# EAGLE design nedonand2 (EAGLE 5.12)
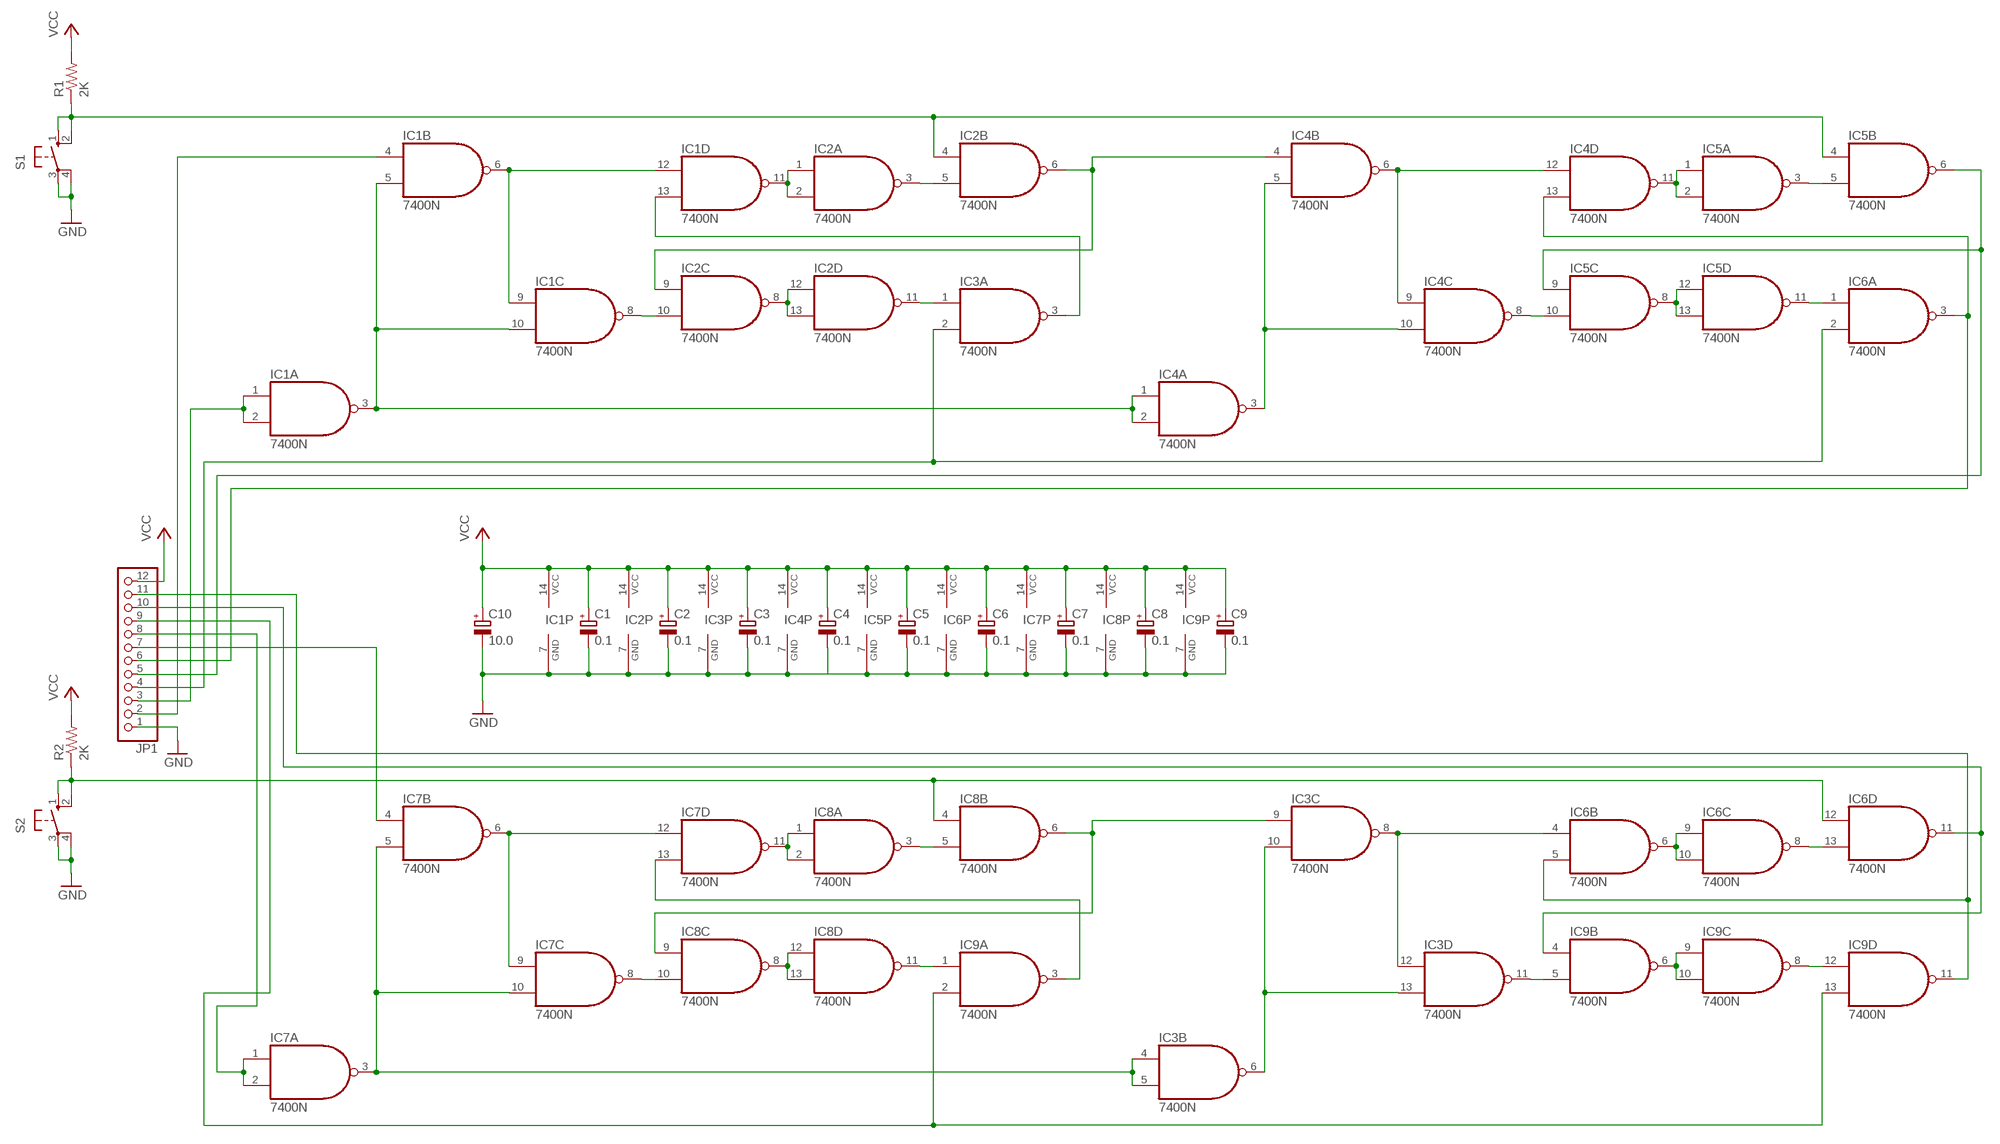
[diagram p0: schematic, sheet 1]

## Parts
C1  0.1  CPOL-EUB45181A  [B45181A]
C2  0.1  CPOL-EUB45181A  [B45181A]
C3  0.1  CPOL-EUB45181A  [B45181A]
C4  0.1  CPOL-EUB45181A  [B45181A]
C5  0.1  CPOL-EUB45181A  [B45181A]
C6  0.1  CPOL-EUB45181A  [B45181A]
C7  0.1  CPOL-EUB45181A  [B45181A]
C8  0.1  CPOL-EUB45181A  [B45181A]
C9  0.1  CPOL-EUB45181A  [B45181A]
C10  10.0  CPOL-EUE2.5-5  [E2,5-5]
IC1  7400N  [DIL14]
IC2  7400N  [DIL14]
IC3  7400N  [DIL14]
IC4  7400N  [DIL14]
IC5  7400N  [DIL14]
IC6  7400N  [DIL14]
IC7  7400N  [DIL14]
IC8  7400N  [DIL14]
IC9  7400N  [DIL14]
JP1  PINHD-1X12/90  [1X12/90]
R1  2K  R-US_0204/7  [0204/7]
R2  2K  R-US_0204/7  [0204/7]
S1  10-XX  [B3F-10XX]
S2  10-XX  [B3F-10XX]

## Nets
GND: C1.- C2.- C3.- C4.- C5.- C6.- C7.- C8.- C9.- C10.- IC1.7(P:GND) IC2.7(P:GND) IC3.7(P:GND) IC4.7(P:GND) IC5.7(P:GND) IC6.7(P:GND) IC7.7(P:GND) IC8.7(P:GND) IC9.7(P:GND) JP1.1 S1.3(P) S1.4(P1) S2.3(P) S2.4(P1)
N$1: IC7.6(B:O) IC7.9(C:I0) IC7.12(D:I0)
N$2: IC1.6(B:O) IC1.9(C:I0) IC1.12(D:I0)
N$3: IC1.8(C:O) IC2.10(C:I1)
N$4: IC2.8(C:O) IC2.12(D:I0) IC2.13(D:I1)
N$5: IC1.11(D:O) IC2.1(A:I0) IC2.2(A:I1)
N$6: IC2.3(A:O) IC2.5(B:I1)
N$7: IC2.11(D:O) IC3.1(A:I0)
N$8: IC7.4(B:I0) JP1.7
N$9: IC7.8(C:O) IC8.10(C:I1)
N$10: IC1.4(B:I0) JP1.2
N$11: IC1.1(A:I0) IC1.2(A:I1) JP1.3
N$12: IC8.8(C:O) IC8.12(D:I0) IC8.13(D:I1)
N$13: IC4.13(D:I1) IC6.3(A:O) JP1.6
N$14: IC2.6(B:O) IC2.9(C:I0) IC4.4(B:I0)
N$15: IC5.6(B:O) IC5.9(C:I0) JP1.5
N$16: IC1.13(D:I1) IC3.3(A:O)
N$17: IC4.3(A:O) IC4.5(B:I1) IC4.10(C:I1)
N$18: IC4.6(B:O) IC4.9(C:I0) IC4.12(D:I0)
N$19: IC4.8(C:O) IC5.10(C:I1)
N$20: IC5.8(C:O) IC5.12(D:I0) IC5.13(D:I1)
N$21: IC4.11(D:O) IC5.1(A:I0) IC5.2(A:I1)
N$22: IC5.3(A:O) IC5.5(B:I1)
N$23: IC5.11(D:O) IC6.1(A:I0)
N$24: IC2.4(B:I0) IC5.4(B:I0) R1.1 S1.1(S) S1.2(S1)
N$25: IC7.11(D:O) IC8.1(A:I0) IC8.2(A:I1)
N$26: IC1.3(A:O) IC1.5(B:I1) IC1.10(C:I1) IC4.1(A:I0) IC4.2(A:I1)
N$27: IC3.2(A:I1) IC6.2(A:I1) JP1.4
N$28: IC8.3(A:O) IC8.5(B:I1)
N$29: IC8.11(D:O) IC9.1(A:I0)
N$31: IC7.1(A:I0) IC7.2(A:I1) JP1.8
N$32: IC6.5(B:I1) IC9.11(D:O) JP1.11
N$33: IC6.11(D:O) IC9.4(B:I0) JP1.10
N$34: IC3.9(C:I0) IC8.6(B:O) IC8.9(C:I0)
N$35: IC7.13(D:I1) IC9.3(A:O)
N$36: IC3.6(B:O) IC3.10(C:I1) IC3.13(D:I1)
N$37: IC3.8(C:O) IC3.12(D:I0) IC6.4(B:I0)
N$38: IC3.11(D:O) IC9.5(B:I1)
N$39: IC9.6(B:O) IC9.9(C:I0) IC9.10(C:I1)
N$40: IC6.6(B:O) IC6.9(C:I0) IC6.10(C:I1)
N$41: IC6.8(C:O) IC6.13(D:I1)
N$42: IC9.8(C:O) IC9.12(D:I0)
N$43: IC6.12(D:I0) IC8.4(B:I0) R2.1 S2.1(S) S2.2(S1)
N$44: IC3.4(B:I0) IC3.5(B:I1) IC7.3(A:O) IC7.5(B:I1) IC7.10(C:I1)
N$45: IC9.2(A:I1) IC9.13(D:I1) JP1.9
VCC: C1.+ C2.+ C3.+ C4.+ C5.+ C6.+ C7.+ C8.+ C9.+ C10.+ IC1.14(P:VCC) IC2.14(P:VCC) IC3.14(P:VCC) IC4.14(P:VCC) IC5.14(P:VCC) IC6.14(P:VCC) IC7.14(P:VCC) IC8.14(P:VCC) IC9.14(P:VCC) JP1.12 R1.2 R2.2

## Library data of the parts
C1-C10 = rcl:CPOL-EU: POLARIZED CAPACITOR, European symbol
IC1-IC9 = 74xx-us:74*00: Quad 2-input NAND gate
JP1 = pinhead:PINHD-1X12: PIN HEADER
R1 R2 = resistor:R-US_: RESISTOR, American symbol
S1 S2 = switch-omron:10-XX: OMRON SWITCH; MPN: B3F-1000; OC_FARNELL: 176432; OC_NEWARK: 36M3542

## Board
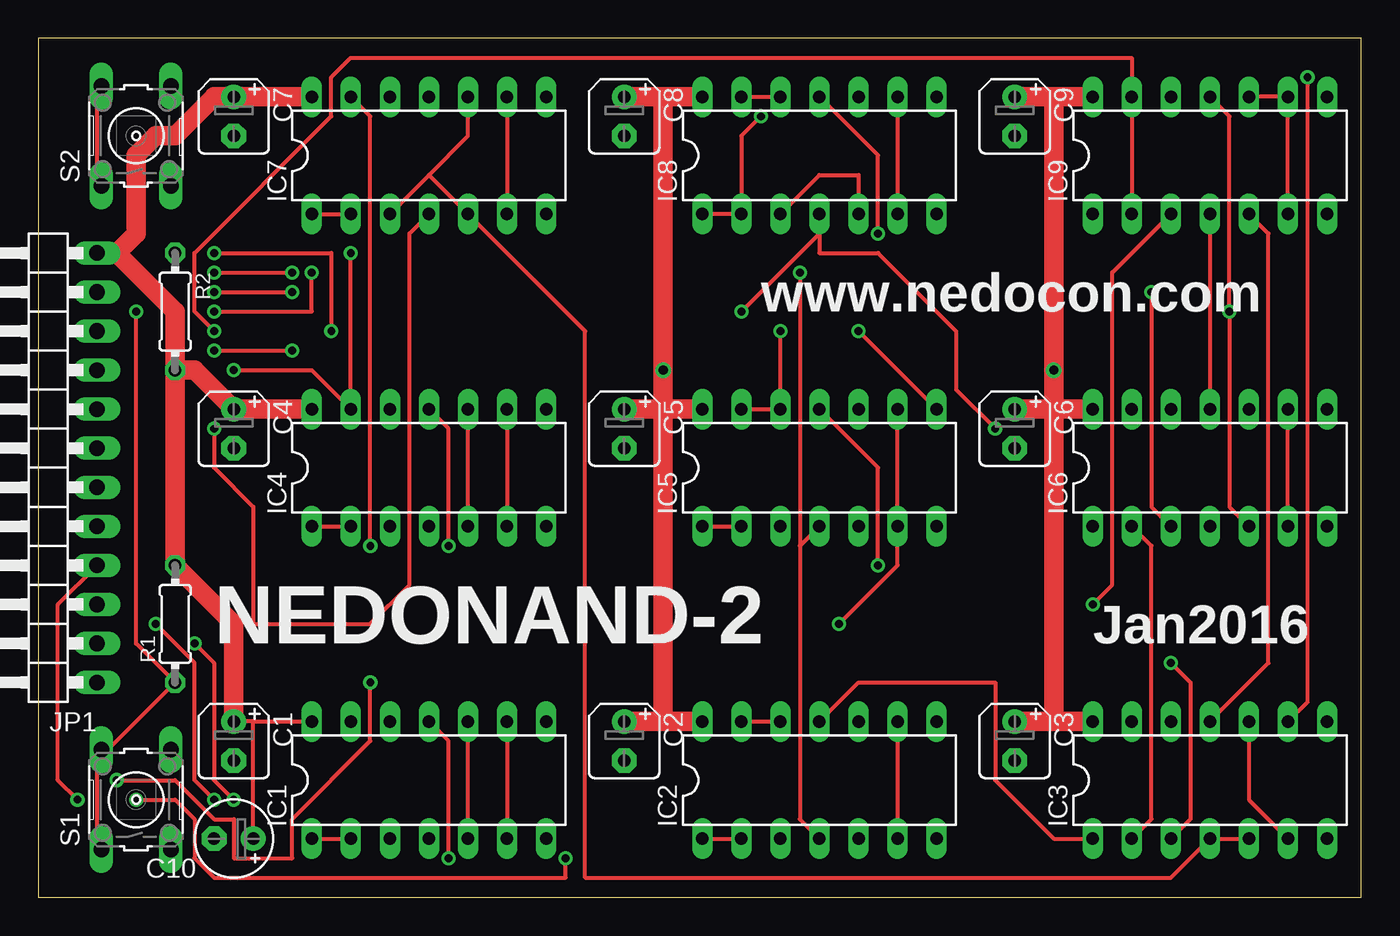
[diagram p1: board, top side]
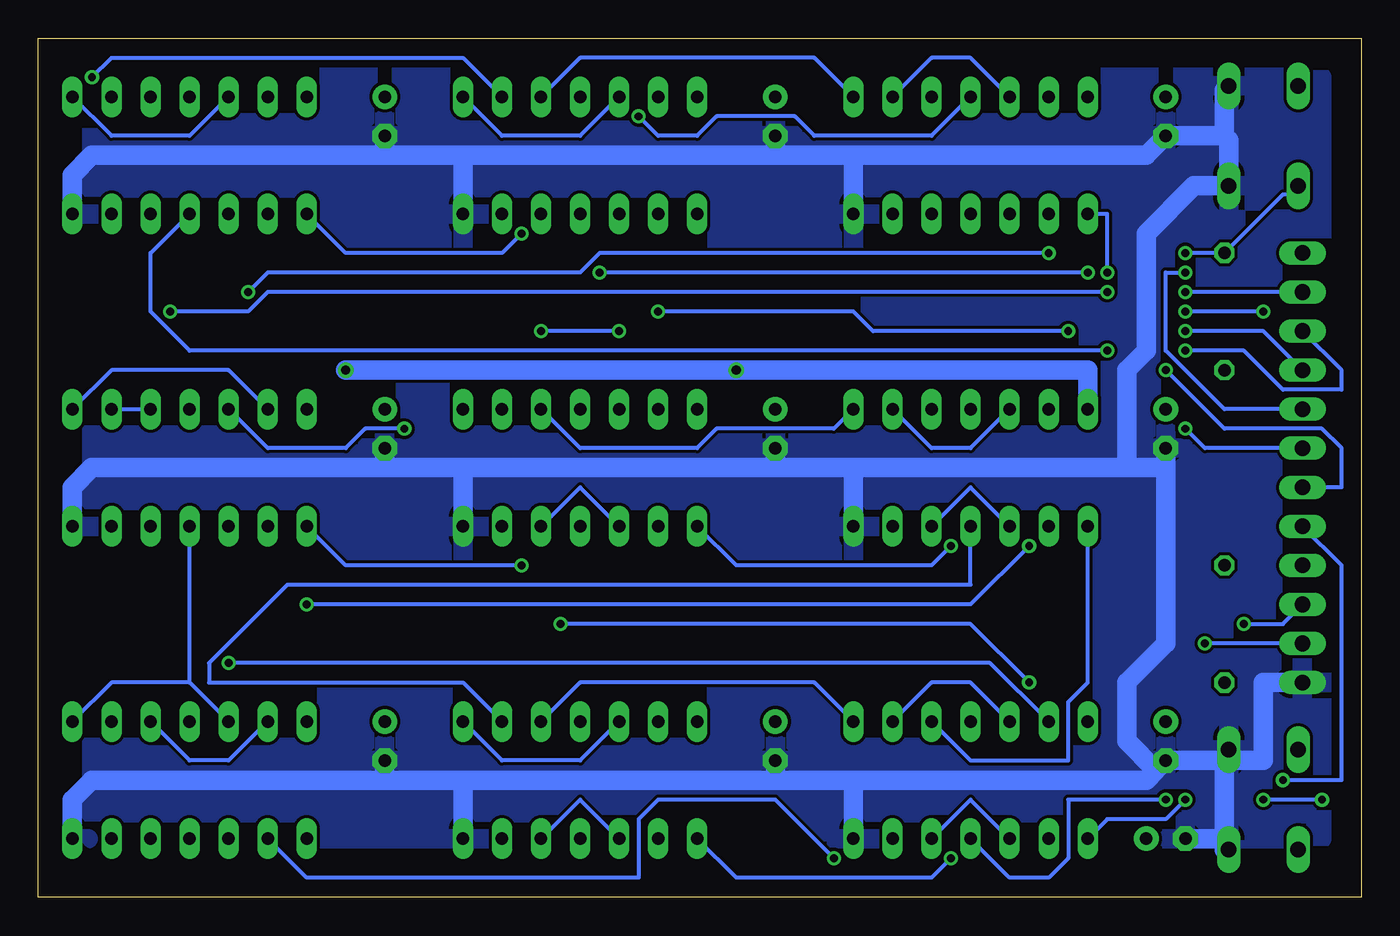
[diagram p2: board, bottom side, seen from below]

Size 86.03 x 55.87 mm. Coordinates in mm from the lower left corner, seen from the top.
Outline: 0,0 86.03,0 86.03,55.87 0,55.87 0,0
Copper layers (1*16): Top 0.035mm / dielectric 1.5mm / Bottom 0.035mm
Design rules "default *": minimum track width 10mil, minimum drill 20mil, track to track 8mil, track to pad 8mil, pad to pad 8mil, via to via 8mil, smd to smd 8mil, copper to edge 40mil, drill to drill 8mil, minimum pad ring 10mil, minimum via ring 8mil, stop-mask expansion 4mil, vias tented up to drill 0mil, thermal gap 10mil

### Footprints (pad centres in the part's own frame; a part is rotated, then mirrored left to right if it is on the bottom)
B45181A = drill 0.813 pad 1.6 round: + -1.27,0 | drill 0.813 pad 1.6 octagon: - 1.27,0
E2,5-5 = drill 0.813 pad 1.6 round: + -1.27,0 | drill 0.813 pad 1.6 octagon: - 1.27,0
DIL14 = drill 0.813 long: 1 -7.62,-3.81; 2 -5.08,-3.81; 3 -2.54,-3.81; 4 0,-3.81; 5 2.54,-3.81; 6 5.08,-3.81; 7 7.62,-3.81; 8 7.62,3.81; 9 5.08,3.81; 10 2.54,3.81; 11 0,3.81; 12 -2.54,3.81; 13 -5.08,3.81; 14 -7.62,3.81
1X12/90 = drill 1.016 long: 1 -13.97,-3.81; 2 -11.43,-3.81; 3 -8.89,-3.81; 4 -6.35,-3.81; 5 -3.81,-3.81; 6 -1.27,-3.81; 7 1.27,-3.81; 8 3.81,-3.81; 9 6.35,-3.81; 10 8.89,-3.81; 11 11.43,-3.81; 12 13.97,-3.81
0204/7 = drill 0.813 octagon: 1 -3.81,0; 2 3.81,0
B3F-10XX = drill 1.016 long: 1 -3.251,2.261; 2 3.251,2.261; 3 -3.251,-2.261; 4 3.251,-2.261

### Placement (x,y rotation side)
C1  12.7,10.16 270 top
C2  38.1,10.16 270 top
C3  63.5,10.16 270 top
C4  12.7,30.48 270 top
C5  38.1,30.48 270 top
C6  63.5,30.48 270 top
C7  12.7,50.8 270 top
C8  38.1,50.8 270 top
C9  63.5,50.8 270 top
C10  12.7,3.81 180 top
IC1  25.4,7.62 0 top
IC2  50.8,7.62 0 top
IC3  76.2,7.62 0 top
IC4  25.4,27.94 0 top
IC5  50.8,27.94 0 top
IC6  76.2,27.94 0 top
IC7  25.4,48.26 0 top
IC8  50.8,48.26 0 top
IC9  76.2,48.26 0 top
JP1  0,27.94 90 top
R1  8.89,17.78 90 top
R2  8.89,38.1 270 top
S1  6.35,6.35 90 top
S2  6.35,49.53 90 top

### Tracks (layer width: path | path; a pad name or v marks a point on that pad's centre or on a via)
GND
  Bottom 1.27: JP1.1 6.35,13.97 6.35,8.89 8.61,8.89 | 8.61,8.89 S1.4 | 8.89,8.89 8.61,8.89 | 8.89,8.89 C1.- 13.34,8.26 | 8.89,3.81 C10.- | 8.89,3.81 8.89,8.89 | S1.3 8.89,3.1 8.89,3.81 | 33.02,7.62 IC1.7 | 33.02,7.62 13.97,7.62 13.34,8.26 | 33.02,7.62 38.1,7.62 | 38.1,7.62 58.42,7.62 | 58.42,7.62 63.5,7.62 | 63.5,7.62 82.55,7.62 83.82,6.35 IC3.7 | 58.42,7.62 IC2.7 | 38.1,7.62 C2.- | 63.5,7.62 C3.- | 12.7,27.94 12.7,16.51 15.24,13.97 15.24,10.16 13.34,8.26 | 12.7,27.94 C4.- | 12.7,27.94 15.24,27.94 | 15.24,27.94 33.02,27.94 | 33.02,27.94 38.1,27.94 | 38.1,27.94 58.42,27.94 | 58.42,27.94 63.5,27.94 | 63.5,27.94 82.55,27.94 83.82,26.67 IC6.7 | 63.5,27.94 C6.- | 38.1,27.94 C5.- | 33.02,27.94 IC4.7 | 58.42,27.94 IC5.7 | 8.89,49.53 C7.- 13.97,48.26 33.02,48.26 | 8.89,49.53 8.89,52.5 S2.4 | 8.89,49.53 8.61,49.25 S2.3 10.87,46.28 13.97,43.18 13.97,35.56 15.24,34.29 15.24,27.94 | IC9.7 83.82,46.99 82.55,48.26 63.5,48.26 | 33.02,48.26 38.1,48.26 | 38.1,48.26 58.42,48.26 | 58.42,48.26 63.5,48.26 | 38.1,48.26 C8.- | 63.5,48.26 C9.- | 58.42,48.26 IC8.7 | 33.02,48.26 IC7.7
  pour Bottom: 2.54,53.34 82.55,53.34 82.55,3.81 2.54,3.81
N$1
  Top 0.254: IC7.9 IC7.6
  Bottom 0.254: IC7.12 25.4,54.61 27.94,54.61 IC7.9
N$2
  Top 0.254: IC1.9 IC1.6
  Bottom 0.254: IC1.12 25.4,13.97 27.94,13.97 IC1.9
N$3
  Bottom 0.254: IC1.8 35.56,13.97 50.8,13.97 IC2.10
N$4
  Top 0.254: IC2.13 IC2.12
  Bottom 0.254: IC2.8 55.88,8.89 50.8,8.89 IC2.12
N$5  (via drill 0.51)
  Top 0.254: IC2.1 IC2.2 | IC1.11 26.67,10.16 v26.67,2.54
  Bottom 0.254: v26.67,2.54 27.94,1.27 40.64,1.27 IC2.1
N$6
  Bottom 0.254: IC2.3 50.8,6.35 IC2.5
N$7
  Top 0.254: IC2.11 53.34,13.97 62.23,13.97 62.23,7.62 66.04,3.81 IC3.1
N$8  (via drill 0.51)
  Top 0.254: IC7.4 24.13,43.18 24.13,20.32 21.59,17.78 13.97,17.78 13.97,25.4 11.43,27.94 v11.43,30.48
  Bottom 0.254: v11.43,30.48 10.16,29.21 JP1.7
N$9
  Bottom 0.254: IC7.8 35.56,54.61 50.8,54.61 IC8.10
N$10  (via drill 0.51)
  Top 0.254: v12.7,6.35 11.43,7.62 11.43,15.24 v10.16,16.51
  Bottom 0.254: IC1.4 22.86,1.27 20.32,1.27 19.05,2.54 19.05,6.35 v12.7,6.35 | JP1.2 v10.16,16.51
N$11  (via drill 0.51)
  Top 0.254: IC1.1 IC1.2 | v7.62,17.78 10.16,15.24 10.16,7.62 v11.43,6.35
  Bottom 0.254: JP1.3 5.08,17.78 v7.62,17.78 | v11.43,6.35 12.7,5.08 16.51,5.08 IC1.1
N$12
  Top 0.254: IC8.13 IC8.12
  Bottom 0.254: IC8.8 55.88,49.53 50.8,49.53 IC8.12
N$13  (via drill 0.51)
  Top 0.254: v12.7,34.29 17.78,34.29 IC4.13 v20.32,41.91 | IC6.3 72.39,25.4 v72.39,39.37
  Bottom 0.254: v12.7,34.29 8.89,30.48 2.54,30.48 1.27,29.21 1.27,26.67 JP1.6 | v72.39,39.37 71.12,40.64 50.8,40.64 49.53,41.91 v20.32,41.91
N$14
  Top 0.254: IC2.9 IC2.6
  Bottom 0.254: IC4.4 25.4,20.32 69.85,20.32 74.93,15.24 74.93,13.97 58.42,13.97 IC2.9
N$15  (via drill 0.51)
  Top 0.254: IC5.9 IC5.6 55.88,21.59 v52.07,17.78 | v5.08,7.62 8.89,7.62 11.43,5.08 12.7,5.08 12.7,2.54 16.51,2.54 16.51,5.08 21.59,10.16 v21.59,13.97
  Bottom 0.254: JP1.5 1.27,21.59 1.27,7.62 v5.08,7.62 | v21.59,13.97 25.4,17.78 v52.07,17.78
N$16  (via drill 0.51)
  Top 0.254: v73.66,15.24 74.93,13.97 74.93,5.08 IC3.3
  Bottom 0.254: IC1.13 24.13,15.24 v73.66,15.24
N$17
  Top 0.254: IC4.5 IC4.10
  Bottom 0.254: IC4.3 25.4,26.67 IC4.5
N$18
  Top 0.254: IC4.9 IC4.6
  Bottom 0.254: IC4.12 25.4,29.21 27.94,29.21 IC4.9
N$19
  Bottom 0.254: IC4.8 34.29,30.48 41.91,30.48 43.18,29.21 50.8,29.21 IC5.10
N$20  (via drill 0.51)
  Top 0.254: IC5.13 IC5.12 v48.26,36.83 | v53.34,36.83 IC5.8
  Bottom 0.254: v48.26,36.83 v53.34,36.83
N$21  (via drill 0.51)
  Top 0.254: IC5.1 IC5.2 | IC4.11 26.67,30.48 v26.67,22.86
  Bottom 0.254: v26.67,22.86 27.94,21.59 40.64,21.59 IC5.1
N$22
  Bottom 0.254: IC5.3 50.8,26.67 IC5.5
N$23  (via drill 0.51)
  Top 0.254: IC5.11 54.61,27.94 v54.61,21.59
  Bottom 0.254: v54.61,21.59 66.04,21.59 IC6.1
N$24  (via drill 0.51)
  Top 0.254: 3.81,8.89 R1.1 6.35,16.51 v6.35,38.1 | 3.81,8.89 3.81,3.81 S1.1 | 3.81,8.89 S1.2 | IC2.4 49.53,5.08 49.53,22.86 | 49.53,22.86 IC5.4 | v11.43,38.1 17.78,38.1 v17.78,40.64 | v49.53,40.64 49.53,22.86
  Bottom 0.254: v6.35,38.1 v11.43,38.1 | v17.78,40.64 v49.53,40.64
N$25  (via drill 0.51)
  Top 0.254: IC8.1 IC8.2 45.72,49.53 v46.99,50.8
  Bottom 0.254: IC7.11 27.94,49.53 35.56,49.53 36.83,50.8 41.91,50.8 43.18,49.53 45.72,49.53 v46.99,50.8
N$26
  Top 0.254: IC4.1 IC4.2 | IC1.5 IC1.10
  Bottom 0.254: IC1.3 25.4,6.35 IC1.5 | IC4.1 17.78,13.97 19.05,12.7 19.05,8.89 25.4,8.89 IC1.10
N$27  (via drill 0.51)
  Top 0.254: IC3.2 72.39,5.08 72.39,22.86 IC6.2 | JP1.4 1.27,19.05 1.27,7.62 v2.54,6.35 | v6.35,6.35 8.89,6.35 10.16,5.08 10.16,2.54 11.43,1.27 34.29,1.27 v34.29,2.54
  Bottom 0.254: v2.54,6.35 v6.35,6.35 | v34.29,2.54 38.1,6.35 45.72,6.35 46.99,5.08 46.99,1.27 68.58,1.27 IC3.2
N$28
  Top 0.254: IC8.3 50.8,46.99 53.34,46.99 IC8.5
N$29  (via drill 0.51)
  Top 0.254: IC8.11 54.61,48.26 v54.61,43.18
  Bottom 0.254: v54.61,43.18 55.88,41.91 66.04,41.91 IC9.1
N$31  (via drill 0.51)
  Top 0.254: IC7.1 IC7.2 | v11.43,40.64 v16.51,40.64
  Bottom 0.254: JP1.8 8.89,31.75 12.7,35.56 12.7,40.64 v11.43,40.64 | v16.51,40.64 16.51,44.45 IC7.1
N$32  (via drill 0.51)
  Top 0.254: IC6.5 77.47,25.4 v77.47,38.1 77.47,50.8 IC9.11 | v11.43,39.37 v16.51,39.37
  Bottom 0.254: JP1.11 v11.43,39.37 | v16.51,39.37 71.12,39.37 72.39,38.1 v77.47,38.1
N$33  (via drill 0.51)
  Top 0.254: IC9.4 IC6.11 | v11.43,35.56 v16.51,35.56
  Bottom 0.254: JP1.10 1.27,34.29 1.27,33.02 5.08,33.02 7.62,35.56 v11.43,35.56 | v16.51,35.56 76.2,35.56 78.74,38.1 78.74,41.91 IC9.4
N$34  (via drill 0.51)
  Top 0.254: IC8.9 IC8.6 | IC3.9 82.55,12.7 v82.55,53.34
  Bottom 0.254: v82.55,53.34 81.28,54.61 58.42,54.61 IC8.9
N$35  (via drill 0.51)
  Top 0.254: IC7.13 21.59,50.8 v21.59,22.86 | v68.58,19.05 69.85,20.32 69.85,40.64 IC9.3
  Bottom 0.254: v21.59,22.86 25.4,19.05 v68.58,19.05
N$36
  Top 0.254: IC3.6 78.74,6.35 IC3.10
  Bottom 0.254: IC3.13 73.66,8.89 76.2,8.89 IC3.10
N$37
  Bottom 0.254: IC3.12 76.2,13.97 | 76.2,13.97 81.28,13.97 IC3.8 | 76.2,13.97 IC6.4
N$38
  Top 0.254: IC3.11 80.01,15.24 80.01,43.18 IC9.5
N$39
  Top 0.254: IC9.10 IC9.9 IC9.6
N$40
  Top 0.254: IC6.6 IC6.9
  Bottom 0.254: IC6.9 IC6.10
N$41
  Bottom 0.254: IC6.13 73.66,34.29 81.28,34.29 IC6.8
N$42
  Bottom 0.254: IC9.12 76.2,49.53 81.28,49.53 IC9.8
N$43  (via drill 0.51)
  Top 0.254: S2.2 3.81,52.07 3.81,46.99 S2.1 | v62.23,30.48 59.69,33.02 59.69,36.83 54.61,41.91 50.8,41.91 50.8,43.18 | v11.43,41.91 19.05,41.91 v19.05,36.83 | v45.72,38.1 50.8,43.18 | 50.8,43.18 IC8.4
  Bottom 0.254: S2.1 3.81,45.72 5.08,45.72 R2.1 v11.43,41.91 | IC6.12 71.12,29.21 66.04,29.21 64.77,30.48 v62.23,30.48 | v19.05,36.83 31.75,36.83 33.02,38.1 v45.72,38.1
N$44
  Top 0.254: IC3.5 IC3.4 73.66,1.27 35.56,1.27 35.56,36.83 IC7.5 25.4,46.99 | 25.4,46.99 27.94,49.53 IC7.10 | 25.4,46.99 IC7.3
N$45  (via drill 0.51)
  Top 0.254: IC9.2 IC9.13 71.12,54.61 20.32,54.61 19.05,53.34 19.05,50.8 10.16,41.91 10.16,38.1 v11.43,36.83
  Bottom 0.254: JP1.9 6.35,36.83 v11.43,36.83
VCC  (via drill 0.6)
  Top 0.254: 13.97,11.43 C1.+ | 13.97,11.43 IC1.14 | C10.+ 13.97,11.43
  Top 1.27: 5.08,41.91 JP1.12 | 5.08,41.91 8.89,38.1 R2.2 | R2.2 10.16,34.29 C4.+ IC4.14 | R2.2 R1.2 12.7,17.78 C1.+ | IC7.14 C7.+ 11.43,52.07 8.89,49.53 7.62,49.53 6.35,48.26 6.35,43.18 5.08,41.91 | 66.04,52.07 IC9.14 | 40.64,31.75 C5.+ | 40.64,31.75 IC5.14 | 66.04,31.75 C6.+ | 66.04,11.43 C3.+ | 66.04,11.43 IC3.14 | 40.64,11.43 IC2.14 | 40.64,31.75 40.64,11.43 | 66.04,31.75 v66.04,34.29 66.04,52.07 | 66.04,31.75 IC6.14 | 66.04,31.75 66.04,11.43 | 40.64,52.07 C8.+ | 40.64,52.07 IC8.14 | 66.04,52.07 C9.+ | 40.64,52.07 v40.64,34.29 40.64,31.75 | 40.64,11.43 C2.+
  Bottom 1.27: v66.04,34.29 v40.64,34.29 17.78,34.29 IC4.14

### Text on the board
tNames: www.nedocon.com | NEDONAND-2 | Jan2016